# Altium schematic sheet PAGE3 - POWER.SchDoc
size A3; DocumentNumber: 1; SheetNumber: 1; SheetTotal: 2
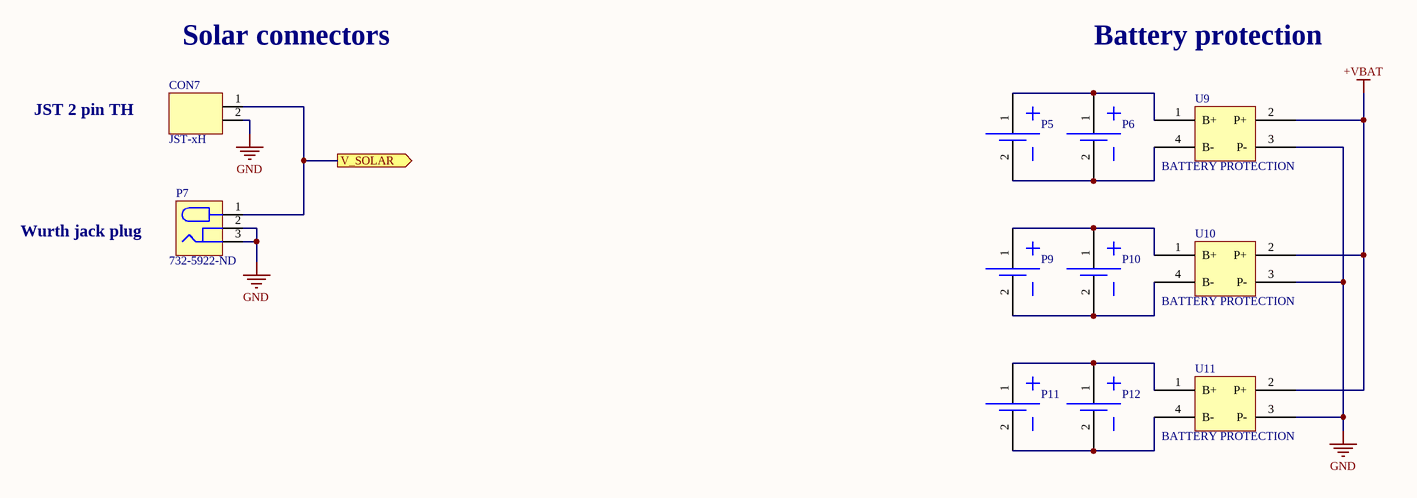
[diagram p0: PAGE3 - POWER.SchDoc]

## Parts
CON7  JST-xH  [JST_2PIN_TH]
P5  BAT - 18650  [BATTERY HOLDER 18650]  (value not drawn)
P6  BAT - 18650  [BATTERY HOLDER 18650]  (value not drawn)
P7  732-5922-ND  [732-5922-ND]
P9  BAT - 18650  [BATTERY HOLDER 18650]  (value not drawn)
P10  BAT - 18650  [BATTERY HOLDER 18650]  (value not drawn)
P11  BAT - 18650  [BATTERY HOLDER 18650]  (value not drawn)
P12  BAT - 18650  [BATTERY HOLDER 18650]  (value not drawn)
U9  BATTERY PROTECTION  [BATTERY PROTECTION]
U10  BATTERY PROTECTION  [BATTERY PROTECTION]
U11  BATTERY PROTECTION  [BATTERY PROTECTION]

## Ports
V_SOLAR (out)

## Nets
+VBAT: U9.2(P+) U10.2(P+) U11.2(P+)
GND: CON7.2 P7.2 P7.3 U9.3(P-) U10.3(P-) U11.3(P-)
V_SOLAR: CON7.1 P7.1 ; port V_SOLAR
NetP5_1: P5.1 P6.1 U9.1(B+)
NetP5_2: P5.2 P6.2 U9.4(B-)
NetP9_1: P9.1 P10.1 U10.1(B+)
NetP9_2: P9.2 P10.2 U10.4(B-)
NetP11_1: P11.1 P12.1 U11.1(B+)
NetP11_2: P11.2 P12.2 U11.4(B-)

## Notes on the sheet
- Solar connectors
- Battery protection
- JST 2 pin TH
- Wurth jack plug
- Size: A3
- Revision:
- Sheet
- of

## Library data of the parts
CON7 = B2B-XH-A (LF)(SN): Wire-To-Board Connector, Vertical, 2.5 mm, 2 Contacts, Header, XH Series, Through Hole, 1 Rows; ComponentLink1Description: Datasheet; ComponentLink1URL: http://www.farnell.com/datasheets/2057209.pdf?_ga=2.26100990.2144023421.1568612611-1741076818.1563951383; Supplier 1: Farnell; Supplier Part Number 1: 1516276
P5 P6 P9-P12 = BAT - 18650: BATERRY HOLDER 18650; Supplier Part Number 1: Battery holder for 18650
P7 = CONN PWR JACK 1.05X3.5MM: Power Barrel Connector Jack 1.05mm ID (0.041"), 3.50mm OD (0.138") Through Hole, Right Angle; ComponentLink1Description: Datasheet; ComponentLink1URL: https://katalog.we-online.de/em/datasheet/6941xx303002.pdf; Supplier 1: Farnell; Supplier Part Number 1: 2472141
U9-U11 = BATTERY PROTECTION: Supplier Part Number 1: Battery protection